# EAGLE design wifilamp2a (EAGLE 7.7.0)
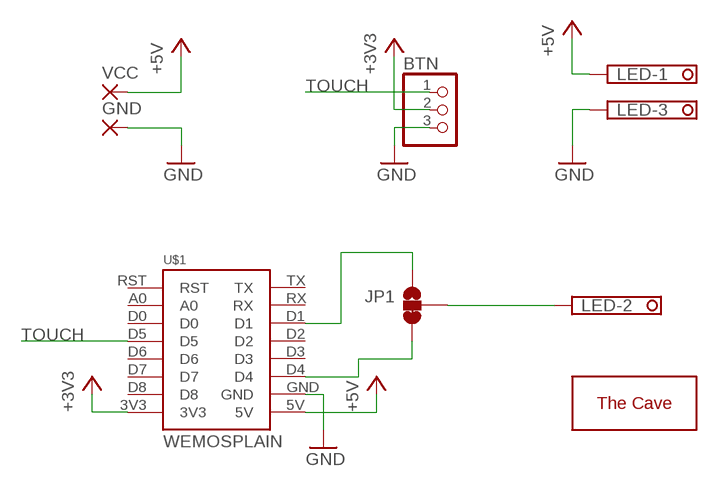
[diagram p0: schematic, sheet 1]

## Parts
BTN  PINHD-1X3  [1X03]
GND  WIREPAD3,81/1,4  [3,81/1,4]
JP1  JUMPER-SMT_3_1-NC_TRACE_NO-SILK  [SMT-JUMPER_3_1-NC_TRACE_NO-SILK]
LED  1751251  [1751251]
U$1  WEMOSPLAIN  [WEMOS-PLAIN]
U$2  THECAVE_LOGO_TOP_SMALL  [LOGO_TOP_SMALL]
VCC  PAD3,81/2  [PAD3,81/2]

## Nets
+3V3: BTN.2 U$1.3V3
+5V: LED.1 U$1.5V VCC.1(P)
GND: BTN.3 GND.1(P) LED.3 U$1.GND
N$1: JP1.1 U$1.D1
N$2: JP1.3 U$1.D4
N$3: JP1.2 LED.2
TOUCH: BTN.1 U$1.D5
Unconnected: U$1.A0 U$1.D0 U$1.D2 U$1.D3 U$1.D6 U$1.D7 U$1.D8 U$1.RST U$1.RX U$1.TX

## Library data of the parts
BTN = pinhead:PINHD-1X3: PIN HEADER
GND = wirepad:WIREPAD: Wire PAD connect wire on PCB
JP1 = SparkFun-Jumpers:JUMPER-SMT_3_1-NC_TRACE: Normally closed trace jumper (1 of 2 connections) This jumper has a trace between two pads so it's normally closed (NC). The other connection is normally open (NO). Use a razor knife to open the connection. For best results follow the IPC guidelines for cutting traces: Cutout at least 0.063 mm (0.005 in). Remove all loose material to clean up the cut area. Seal the cut with an approved epoxy. Reapply solder to reclose the connection, or to close the NO connection.
LED = con-phoenix-350:1751251: MKDS 1/ 3-3,5 Printklemme Nennstrom: 10 A Bemessungsspannung: 160 V Raster: 3,5 mm Polzahl: 3 Montageart: Löten Anschlussart: Schraubanschluss Anschlussrichtung vom Leiter zur Platine: 0° Source: http://eshop.phoenixcontact.com .. 1751251.pdf; OC_FARNELL: unknown; OC_NEWARK: unknown
U$1 = d1-mini:WEMOS
U$2 = thecave:THECAVE_LOGO: The Cave DIY workshop logos thecave.cz
VCC = thecave:PAD3,81/2

## Board
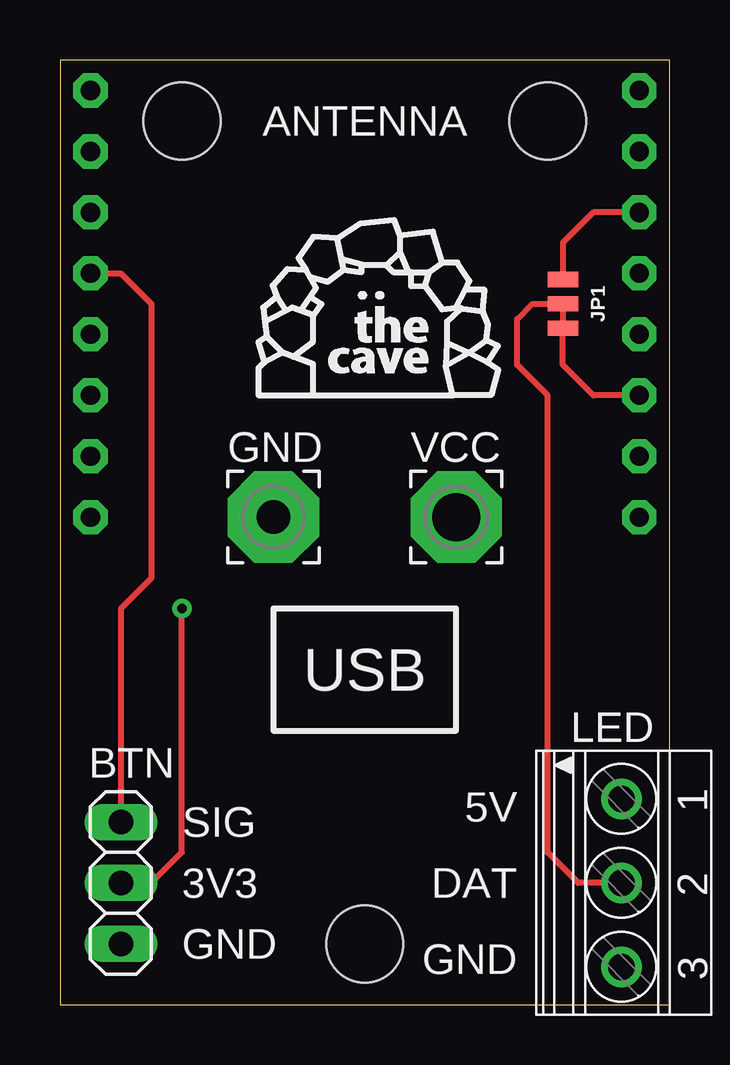
[diagram p1: board, top side]
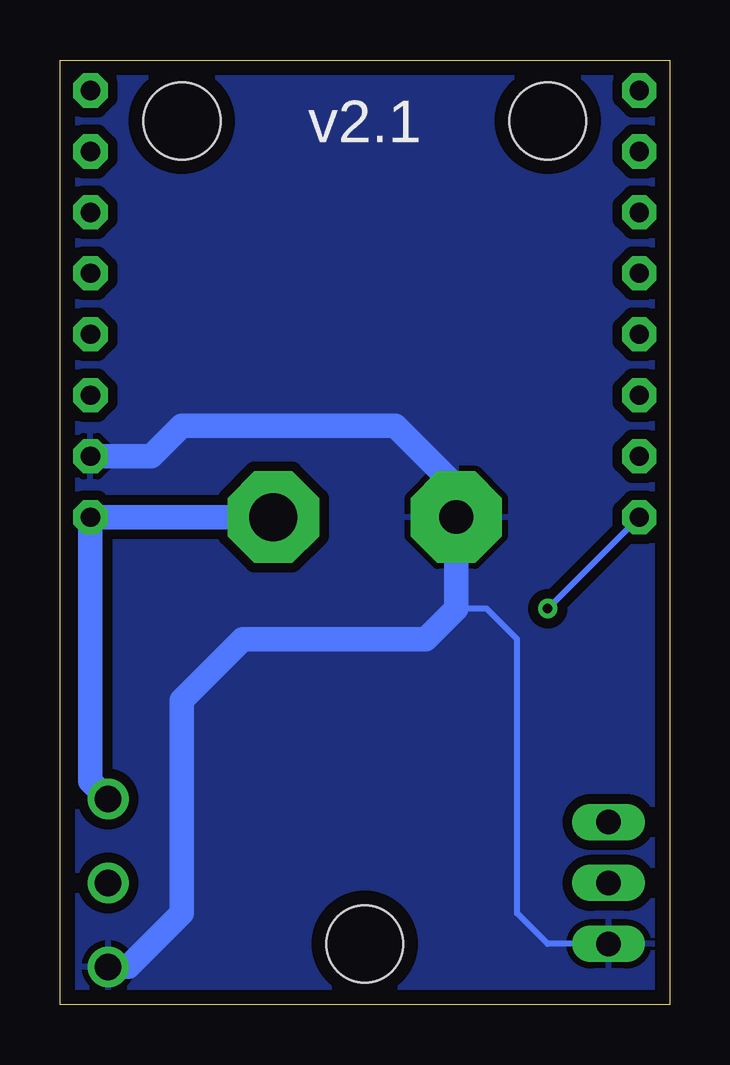
[diagram p2: board, bottom side, seen from below]

Size 25.4 x 39.37 mm. Coordinates in mm from the lower left corner, seen from the top.
Outline: 0,0 25.4,0 25.4,39.37 0,39.37 0,0
Copper layers (1*16): Top 0.035mm / dielectric 1.5mm / Bottom 0.035mm
Design rules "default *": minimum track width 10mil, minimum drill 24mil, track to track 10mil, track to pad 10mil, pad to pad 10mil, via to via 10mil, smd to smd 10mil, copper to edge 24mil, drill to drill 16mil, minimum pad ring 10mil, minimum via ring 8mil, stop-mask expansion 4mil, vias tented up to drill 0.4mm, thermal gap 10mil
Holes 3.2 mm at 20.32,36.83 5.08,36.83 12.7,2.54

### Footprints (pad centres in the part's own frame; a part is rotated, then mirrored left to right if it is on the bottom)
1X03 = drill 1.016 long: 1 -2.54,0; 2 0,0; 3 2.54,0
3,81/1,4 = drill 1.397 pad 3.81 octagon: 1 0,0
SMT-JUMPER_3_1-NC_TRACE_NO-SILK = smd 0.635 x 1.27: 1 -1.016,0; 2 0,0; 3 1.016,0
1751251 = drill 1.1 pad 1.7: 1 -3.5,-0.1; 2 0,-0.1; 3 3.5,-0.1
WEMOS-PLAIN = drill 0.8 pad 1.422 octagon: 3V3 0,0; 5V 22.86,0; A0 0,15.24; D0 0,12.7; D1 22.86,12.7; D2 22.86,10.16; D3 22.86,7.62; D4 22.86,5.08; D5 0,10.16; D6 0,7.62; D7 0,5.08; D8 0,2.54; GND 22.86,2.54; RST 0,17.78; RX 22.86,15.24; TX 22.86,17.78
PAD3,81/2 = drill 2 pad 3.81 octagon: 1 0,0

### Placement (x,y rotation side)
BTN  2.54,5.08 270 top
GND  8.89,20.32 0 top
JP1  20.95,29.21 270 top
LED  23.5,5.08 270 top
U$1  1.27,20.32 0 top
U$2  8.26,25.4 0 top
VCC  16.51,20.32 0 top

### Tracks (layer width: path | path; a pad name or v marks a point on that pad's centre or on a via)
+3V3  (via drill 0.4)
  Top 0.254: BTN.2 3.81,5.08 5.08,6.35 v5.08,16.51
  Bottom 0.254: v5.08,16.51 U$1.3V3
+5V
  Bottom 1.016: VCC.1 U$1.5V 24.13,9.31 LED.1
GND
  Bottom 0.254: BTN.3 5.08,2.54 6.35,3.81 6.35,15.24 7.62,16.51 8.89,16.51
  Bottom 1.016: LED.3 22.55,1.58 20.32,3.81 20.32,12.7 17.78,15.24 10.16,15.24 8.89,16.51 GND.1 8.89,21.59 11.43,24.13 20.32,24.13 21.59,22.86 U$1.GND
  pour Bottom (isolate 0.406): 0,39.37 25.4,39.37 25.4,0 0,0
N$1
  Top 0.254: U$1.D1 22.23,33.02 20.95,31.75 JP1.1
N$2
  Top 0.254: U$1.D4 22.23,25.4 20.95,26.67 JP1.3
N$3
  Top 0.254: LED.2 21.59,5.08 20.32,6.35 20.32,25.4 19.05,26.67 19.05,28.57 19.68,29.21 JP1.2
TOUCH
  Top 0.254: U$1.D5 2.54,30.48 3.81,29.21 3.81,17.78 2.54,16.51 BTN.1

### Text on the board
tPlace: ANTENNA | USB
tNames: SIG | 5V | 3V3 | DAT | GND | GND
bNames: v2.1